# Altium schematic sheet PCB_Calc.SchDoc
size A2; SheetNumber: 1; SheetTotal: 1
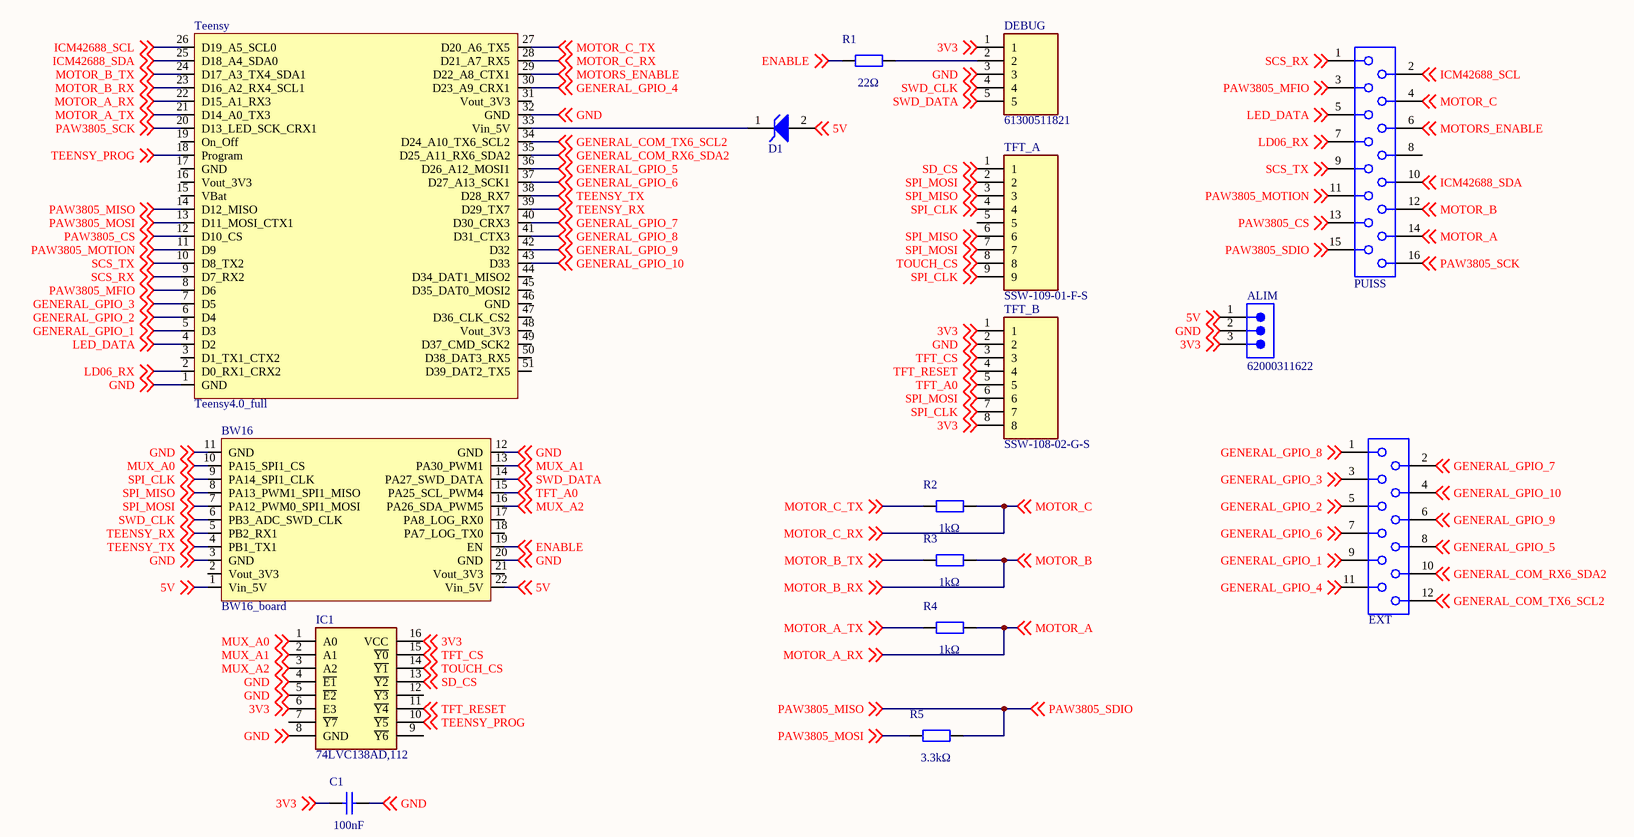
[diagram p0: PCB_Calc.SchDoc]

## Parts
ALIM  62000311622  [62000311622]
BW16  BW16_board  [BW16_board]
C1  100nF  [WCAP-CSGP_0603_L1.6W0.8H0.8_Reflow]
D1  400W, 5VDC  [WE-TVSP_DO-214AC_Unidirectional]  (value not drawn)
DEBUG  61300511821  [61300511821]
EXT  690367181272  [690367181272]  (value not drawn)
IC1  74LVC138AD,112  [SOIC127P600X175-16N]
PUISS  690367181672  [690367181672]  (value not drawn)
R1  22Ω  [WRIS-RSKS_0603_Reflow]
R2  1kΩ  [WRIS-RSKS_0603_Reflow]
R3  1kΩ  [WRIS-RSKS_0603_Reflow]
R4  1kΩ  [WRIS-RSKS_0603_Reflow]
R5  3.3kΩ  [WRIS-RSKS_0603_Reflow]
Teensy  Teensy4.0_full  [Teensy4.0_full]
TFT_A  SSW-109-01-F-S  [61301015721]
TFT_B  SSW-108-02-G-S  [61300815721]

## Nets
3V3: ALIM.3 C1.1 DEBUG.1 IC1.6(E3) IC1.16(VCC) TFT_B.1 TFT_B.8 ; off-sheet 3V3
5V: ALIM.1 BW16.1(Vin_5V) BW16.22(Vin_5V) D1.2(A) ; off-sheet 5V
ENABLE: BW16.19(EN) R1.1 ; off-sheet ENABLE
GENERAL_COM_RX6_SDA2: EXT.10 Teensy.35(D25_A11_RX6_SDA2) ; off-sheet GENERAL_COM_RX6_SDA2
GENERAL_COM_TX6_SCL2: EXT.12 Teensy.34(D24_A10_TX6_SCL2) ; off-sheet GENERAL_COM_TX6_SCL2
GENERAL_GPIO_1: EXT.9 Teensy.5(D3) ; off-sheet GENERAL_GPIO_1
GENERAL_GPIO_2: EXT.5 Teensy.6(D4) ; off-sheet GENERAL_GPIO_2
GENERAL_GPIO_3: EXT.3 Teensy.7(D5) ; off-sheet GENERAL_GPIO_3
GENERAL_GPIO_4: EXT.11 Teensy.30(D23_A9_CRX1) ; off-sheet GENERAL_GPIO_4
GENERAL_GPIO_5: EXT.8 Teensy.36(D26_A12_MOSI1) ; off-sheet GENERAL_GPIO_5
GENERAL_GPIO_6: EXT.7 Teensy.37(D27_A13_SCK1) ; off-sheet GENERAL_GPIO_6
GENERAL_GPIO_7: EXT.2 Teensy.40(D30_CRX3) ; off-sheet GENERAL_GPIO_7
GENERAL_GPIO_8: EXT.1 Teensy.41(D31_CTX3) ; off-sheet GENERAL_GPIO_8
GENERAL_GPIO_9: EXT.6 Teensy.42(D32) ; off-sheet GENERAL_GPIO_9
GENERAL_GPIO_10: EXT.4 Teensy.43(D33) ; off-sheet GENERAL_GPIO_10
GND: ALIM.2 BW16.3(GND) BW16.11(GND) BW16.12(GND) BW16.20(GND) C1.2 DEBUG.3 IC1.4(~{E1}) IC1.5(~{E2}) IC1.8(GND) Teensy.1(GND) Teensy.32(GND) TFT_B.2 ; off-sheet GND
ICM42688_SCL: PUISS.2 Teensy.26(D19_A5_SCL0) ; off-sheet ICM42688_SCL
ICM42688_SDA: PUISS.10 Teensy.25(D18_A4_SDA0) ; off-sheet ICM42688_SDA
LD06_RX: PUISS.7 Teensy.2(D0_RX1_CRX2) ; off-sheet LD06_RX
LED_DATA: PUISS.5 Teensy.4(D2) ; off-sheet LED_DATA
MOTOR_A: PUISS.14 R4.2 Teensy.22(D15_A1_RX3) ; off-sheet MOTOR_A_RX, off-sheet MOTOR_A  [also labelled MOTOR_A_RX]
MOTOR_A_TX: R4.1 Teensy.21(D14_A0_TX3) ; off-sheet MOTOR_A_TX
MOTOR_B: PUISS.12 R3.2 Teensy.23(D16_A2_RX4_SCL1) ; off-sheet MOTOR_B_RX, off-sheet MOTOR_B  [also labelled MOTOR_B_RX]
MOTOR_B_TX: R3.1 Teensy.24(D17_A3_TX4_SDA1) ; off-sheet MOTOR_B_TX
MOTOR_C: PUISS.4 R2.2 Teensy.28(D21_A7_RX5) ; off-sheet MOTOR_C_RX, off-sheet MOTOR_C  [also labelled MOTOR_C_RX]
MOTOR_C_TX: R2.1 Teensy.27(D20_A6_TX5) ; off-sheet MOTOR_C_TX
MOTORS_ENABLE: PUISS.6 Teensy.29(D22_A8_CTX1) ; off-sheet MOTORS_ENABLE
MUX_A0: BW16.10(PA15_SPI1_CS) IC1.1(A0) ; off-sheet MUX_A0
MUX_A1: BW16.13(PA30_PWM1) IC1.2(A1) ; off-sheet MUX_A1
MUX_A2: BW16.16(PA26_SDA_PWM5) IC1.3(A2) ; off-sheet MUX_A2
PAW3805_CS: PUISS.13 Teensy.12(D10_CS) ; off-sheet PAW3805_CS
PAW3805_MFIO: PUISS.3 Teensy.8(D6) ; off-sheet PAW3805_MFIO
PAW3805_MISO: PUISS.15 R5.2 Teensy.14(D12_MISO) ; off-sheet PAW3805_MISO, off-sheet PAW3805_SDIO  [also labelled PAW3805_SDIO]
PAW3805_MOSI: R5.1 Teensy.13(D11_MOSI_CTX1) ; off-sheet PAW3805_MOSI
PAW3805_MOTION: PUISS.11 Teensy.11(D9) ; off-sheet PAW3805_MOTION
PAW3805_SCK: PUISS.16 Teensy.20(D13_LED_SCK_CRX1) ; off-sheet PAW3805_SCK
SCS_RX: PUISS.1 Teensy.9(D7_RX2) ; off-sheet SCS_RX
SCS_TX: PUISS.9 Teensy.10(D8_TX2) ; off-sheet SCS_TX
SD_CS: IC1.13(~{Y2}) TFT_A.1 ; off-sheet SD_CS
SPI_CLK: BW16.9(PA14_SPI1_CLK) TFT_A.4 TFT_A.9 TFT_B.7 ; off-sheet SPI_CLK
SPI_MISO: BW16.8(PA13_PWM1_SPI1_MISO) TFT_A.3 TFT_A.6 ; off-sheet SPI_MISO
SPI_MOSI: BW16.7(PA12_PWM0_SPI1_MOSI) TFT_A.2 TFT_A.7 TFT_B.6 ; off-sheet SPI_MOSI
SWD_CLK: BW16.6(PB3_ADC_SWD_CLK) DEBUG.4 ; off-sheet SWD_CLK
SWD_DATA: BW16.14(PA27_SWD_DATA) DEBUG.5 ; off-sheet SWD_DATA
TEENSY_PROG: IC1.10(~{Y5}) Teensy.18(Program) ; off-sheet TEENSY_PROG
TEENSY_RX: BW16.5(PB2_RX1) Teensy.39(D29_TX7) ; off-sheet TEENSY_RX
TEENSY_TX: BW16.4(PB1_TX1) Teensy.38(D28_RX7) ; off-sheet TEENSY_TX
TFT_A0: BW16.15(PA25_SCL_PWM4) TFT_B.5 ; off-sheet TFT_A0
TFT_CS: IC1.15(~{Y0}) TFT_B.3 ; off-sheet TFT_CS
TFT_RESET: IC1.11(~{Y4}) TFT_B.4 ; off-sheet TFT_RESET
TOUCH_CS: IC1.14(~{Y1}) TFT_A.8 ; off-sheet TOUCH_CS
NetD1_1: D1.1(K) Teensy.33(Vin_5V)
NetDEBUG_2: DEBUG.2 R1.2

Not connected (* = marked no-connect by the designer): BW16 2(Vout_3V3) 17(PA8_LOG_RX0) 18(PA7_LOG_TX0) 21(Vout_3V3); IC1 7(~{Y7}) 9(~{Y6}) 12(~{Y3}); PUISS 8; Teensy 3(D1_TX1_CTX2) 15(VBat) 16(Vout_3V3) 17(GND) 19(On_Off) 31(Vout_3V3) 44(D34_DAT1_MISO2) 45(D35_DAT0_MOSI2) 46(GND) 47(D36_CLK_CS2) 48(Vout_3V3) 49(D37_CMD_SCK2) 50(D38_DAT3_RX5) 51(D39_DAT2_TX5); TFT_A 5

## Library data of the parts
ALIM = 62000311622: WR-WTB Male Vertical Shrouded Header, pitch 2 mm, 3 pins; Manufacturer: Wurth Elektronik; Contact Resistance: 20 mΩ; Pitch: 2 mm; Rated Current: 2 A; Working Voltage: 125 V(AC); Withstanding Voltage: 800 V(AC); Manufacturer Part Number: 62000311622; Category: Wire-to-Board Connector; Match Code: WR-WTB; ComponentLink1Description: Website Link; ComponentLink1URL: https://www.we-online.com/redexpert/article/62000311622?ad; ComponentLink2Description: Datasheet Link; ComponentLink2URL: https://www.we-online.com/redexpert/spec/62000311622?ad; Mount: Through Hole; Min Operating Temperature: -25 °C; Max Operating Temperature: 85 °C; Packaging: Bag; Length: 8 mm; Width: 4.7 mm; Height: 6.1 mm; Gender: Male; Number of Pins: 3; Number of Rows: 1; Orientation: Vertical
C1 = 885012206046: WCAP-CSGP Multilayer Ceramic Chip Capacitor, General Purpose, size 0603, 100nF, 16V; Manufacturer: Wurth Elektronik; Case/Size Code: 0603; Capacitance Tolerance: +/-10%; Ceramic Type: X7R; Dissipation Factor: 3.5%; Insulation Resistance: 5GΩ; Technical Reference: X7R0603104K016DFCT10000; Manufacturer Part Number: 885012206046; Category: Multilayer Ceramic Chip Capacitors; Match Code: WCAP-CSGP; ComponentLink1Description: Website Link; ComponentLink1URL: https://www.we-online.com/redexpert/article/885012206046?ad; ComponentLink2Description: Datasheet Link; ComponentLink2URL: https://www.we-online.com/redexpert/spec/885012206046?ad; Mount: Surface Mount; Min Operating Temperature: -55°C; Max Operating Temperature: 125°C; Packaging: Tape and Reel; Length: 1.6mm; Width: 0.8mm; Height: 0.8mm; Capacitance: 100nF; Rated Voltage (DC): 16V
D1 = 824500500: WE-TVSP SMT Power TVS Diode, DO-214AC, Unidirectional, 400W, 5VDC; Manufacturer: Wurth Elektronik; Clamping Voltage: 9.2V; Operating Voltage (DC): 5V; (Reverse) Breakdown Voltage: 6.7V; (Reverse) Peak Pulse Current: 43.5A; ComponentLink1Description: Website Link; ComponentLink1URL: https://www.we-online.com/redexpert/article/824500500?ad; ComponentLink2Description: Datasheet Link; ComponentLink2URL: https://www.we-online.com/redexpert/spec/824500500?ad; Manufacturer Part Number: 824500500; Category: Surge Protection; Match Code: WE-TVSP; Mount: Surface Mount; Operating Temperature Max: 150°C; Operating Temperature Min: -65°C; Packaging: Tape and Reel; Case/Size Code: DO-214AC; Length: 4.24mm; Width: 2.67mm; Height: 2.25mm; Polarity: Unidirectional; Power Dissipation: 400W
DEBUG = 61300511821: Connector; Manufacturer_Name: Wurth Elektronik; Datasheet Link: https://www.we-online.com/components/products/download/1+%28rev1%29.pdf; Height: 8.65mm; Manufacturer_Part_Number: 61300511821; Mouser Part Number: 710-61300511821; Mouser Price/Stock: https://www.mouser.co.uk/ProductDetail/Wurth-Elektronik/61300511821?qs=iLbezkQI%252BsjtLywwvTh3KA%3D%3D
EXT = 690367181272: WR-MM Mini Module Connector, Female, THT, without Latch & Polarization, Straight, pitch 2.54mm, 12p; Manufacturer: Wurth Elektronik; Contact Resistance: 10mΩ; Insulation Resistance: 1000MΩ; Rated Current: 1.5A; Working Voltage: 250VAC; Withstanding Voltage: 500VAC; ComponentLink1Description: Website Link; ComponentLink1URL: https://www.we-online.com/redexpert/article/690367181272?ad; ComponentLink2Description: Datasheet Link; ComponentLink2URL: https://www.we-online.com/redexpert/spec/690367181272?ad; Manufacturer Part Number: 690367181272; Category: Board-to-Board Connectors; Match Code: WR-MM; Mount: Through Hole; Operating Temperature Max: 105°C; Operating Temperature Min: -40°C; Packaging: Tube; Length: 17.24mm; Gender: Female; Number of Pins: 12; Orientation: Straight; Pitch: 2.54mm
IC1 = 74LVC138AD,112: Integrated Circuit; Manufacturer_Name: Nexperia; Datasheet Link: https://assets.nexperia.com/documents/data-sheet/74LVC138A.pdf; Height: 1.75mm; Manufacturer_Part_Number: 74LVC138AD,112; Mouser Part Number: 771-LVC138AD112; Mouser Price/Stock: https://www.mouser.com/Search/Refine.aspx?Keyword=771-LVC138AD112; Arrow Part Number: 74LVC138AD,112; Arrow Price/Stock: https://www.arrow.com/en/products/74lvc138ad112/nexperia?region=europe
PUISS = 690367181672: WR-MM Mini Module Connector, Female, THT, without Latch & Polarization, Straight, pitch 2.54mm, 16p; Manufacturer: Wurth Elektronik; Contact Resistance: 10mΩ; Insulation Resistance: 1000MΩ; Rated Current: 1.5A; Working Voltage: 250VAC; Withstanding Voltage: 500VAC; ComponentLink1Description: Website Link; ComponentLink1URL: https://www.we-online.com/redexpert/article/690367181672?ad; ComponentLink2Description: Datasheet Link; ComponentLink2URL: https://www.we-online.com/redexpert/spec/690367181672?ad; Manufacturer Part Number: 690367181672; Category: Board-to-Board Connectors; Match Code: WR-MM; Mount: Through Hole; Operating Temperature Max: 105°C; Operating Temperature Min: -40°C; Packaging: Tube; Length: 22.32mm; Gender: Female; Number of Pins: 16; Orientation: Straight; Pitch: 2.54mm
R1 = 560112116043: WRIS-RSKS Thick Film Resistor, size 0603, 22Ω, +/-5%, 100mW; Manufacturer: Wurth Elektronik; Case/Size Code: 0603; Limiting Element Voltage: 75V; Temperature Coefficient of Resistance Min: -100ppm/°C; Temperature Coefficient of Resistance Max: 100ppm/°C; Manufacturer Part Number: 560112116043; Category: Thick Film Resistors; Match Code: WRIS-RSKS; ComponentLink1Description: Website Link; ComponentLink1URL: https://www.we-online.com/redexpert/article/560112116043?ad; ComponentLink2Description: Datasheet Link; ComponentLink2URL: https://www.we-online.com/redexpert/spec/560112116043?ad; Mount: Surface Mount; Min Operating Temperature: -55°C; Max Operating Temperature: 155°C; Packaging: Tape and Reel; Length: 1.6mm; Width: 0.8mm; Height: 0.45mm; Rated Power: 100mW; Resistance: 22Ω; Resistance Tolerance: +/-5%
R2-R4 = 560112116016: WRIS-RSKS Thick Film Resistor, size 0603, 1kΩ, +/-5%, 100mW; Manufacturer: Wurth Elektronik; Case/Size Code: 0603; Limiting Element Voltage: 75V; Temperature Coefficient of Resistance Min: -100ppm/°C; Temperature Coefficient of Resistance Max: 100ppm/°C; Manufacturer Part Number: 560112116016; Category: Thick Film Resistors; Match Code: WRIS-RSKS; ComponentLink1Description: Website Link; ComponentLink1URL: https://www.we-online.com/redexpert/article/560112116016?ad; ComponentLink2Description: Datasheet Link; ComponentLink2URL: https://www.we-online.com/redexpert/spec/560112116016?ad; Mount: Surface Mount; Min Operating Temperature: -55°C; Max Operating Temperature: 155°C; Packaging: Tape and Reel; Length: 1.6mm; Width: 0.8mm; Height: 0.45mm; Rated Power: 100mW; Resistance: 1kΩ; Resistance Tolerance: +/-5%
R5 = 560112116047: WRIS-RSKS Thick Film Resistor, size 0603, 3.3kΩ, +/-1%, 100mW; Manufacturer: Wurth Elektronik; Case/Size Code: 0603; Limiting Element Voltage: 75V; Temperature Coefficient of Resistance Min: -100ppm/°C; Temperature Coefficient of Resistance Max: 100ppm/°C; Manufacturer Part Number: 560112116047; Category: Thick Film Resistors; Match Code: WRIS-RSKS; ComponentLink1Description: Website Link; ComponentLink1URL: https://www.we-online.com/redexpert/article/560112116047?ad; ComponentLink2Description: Datasheet Link; ComponentLink2URL: https://www.we-online.com/redexpert/spec/560112116047?ad; Mount: Surface Mount; Min Operating Temperature: -55°C; Max Operating Temperature: 155°C; Packaging: Tape and Reel; Length: 1.6mm; Width: 0.8mm; Height: 0.45mm; Rated Power: 100mW; Resistance: 3.3kΩ; Resistance Tolerance: +/-1%
TFT_A = SSW-109-01-F-S: Connector; Manufacturer_Name: SAMTEC; Datasheet Link: http://suddendocs.samtec.com/prints/ssw-1xx-xx-xxx-x-xx-xxx-xx-mkt.pdf; Height: 8.51mm; Manufacturer_Part_Number: SSW-109-01-F-S; Mouser Part Number: 200-SSW10901FS; Mouser Price/Stock: https://www.mouser.co.uk/ProductDetail/Samtec/SSW-109-01-F-S?qs=rU5fayqh%252BE1LDE5TOsEudw%3D%3D; Arrow Part Number: SSW-109-01-F-S; Arrow Price/Stock: https://www.arrow.com/en/products/ssw-109-01-f-s/samtec
TFT_B = SSW-108-02-G-S: Connector; Manufacturer_Name: SAMTEC; Datasheet Link: https://componentsearchengine.com/Datasheets/1/SSW-108-02-G-S-LL.pdf; Height: 8.51mm; Manufacturer_Part_Number: SSW-108-02-G-S; Mouser Part Number: 200-SSW10802GS; Mouser Price/Stock: https://www.mouser.co.uk/ProductDetail/Samtec/SSW-108-02-G-S?qs=rU5fayqh%252BE1JXJ1Fey24nA%3D%3D; Arrow Part Number: SSW-108-02-G-S; Arrow Price/Stock: https://www.arrow.com/en/products/ssw-108-02-g-s/samtec?region=nac